# EAGLE schematic ball_speed_sensor (EAGLE 9.5.0)
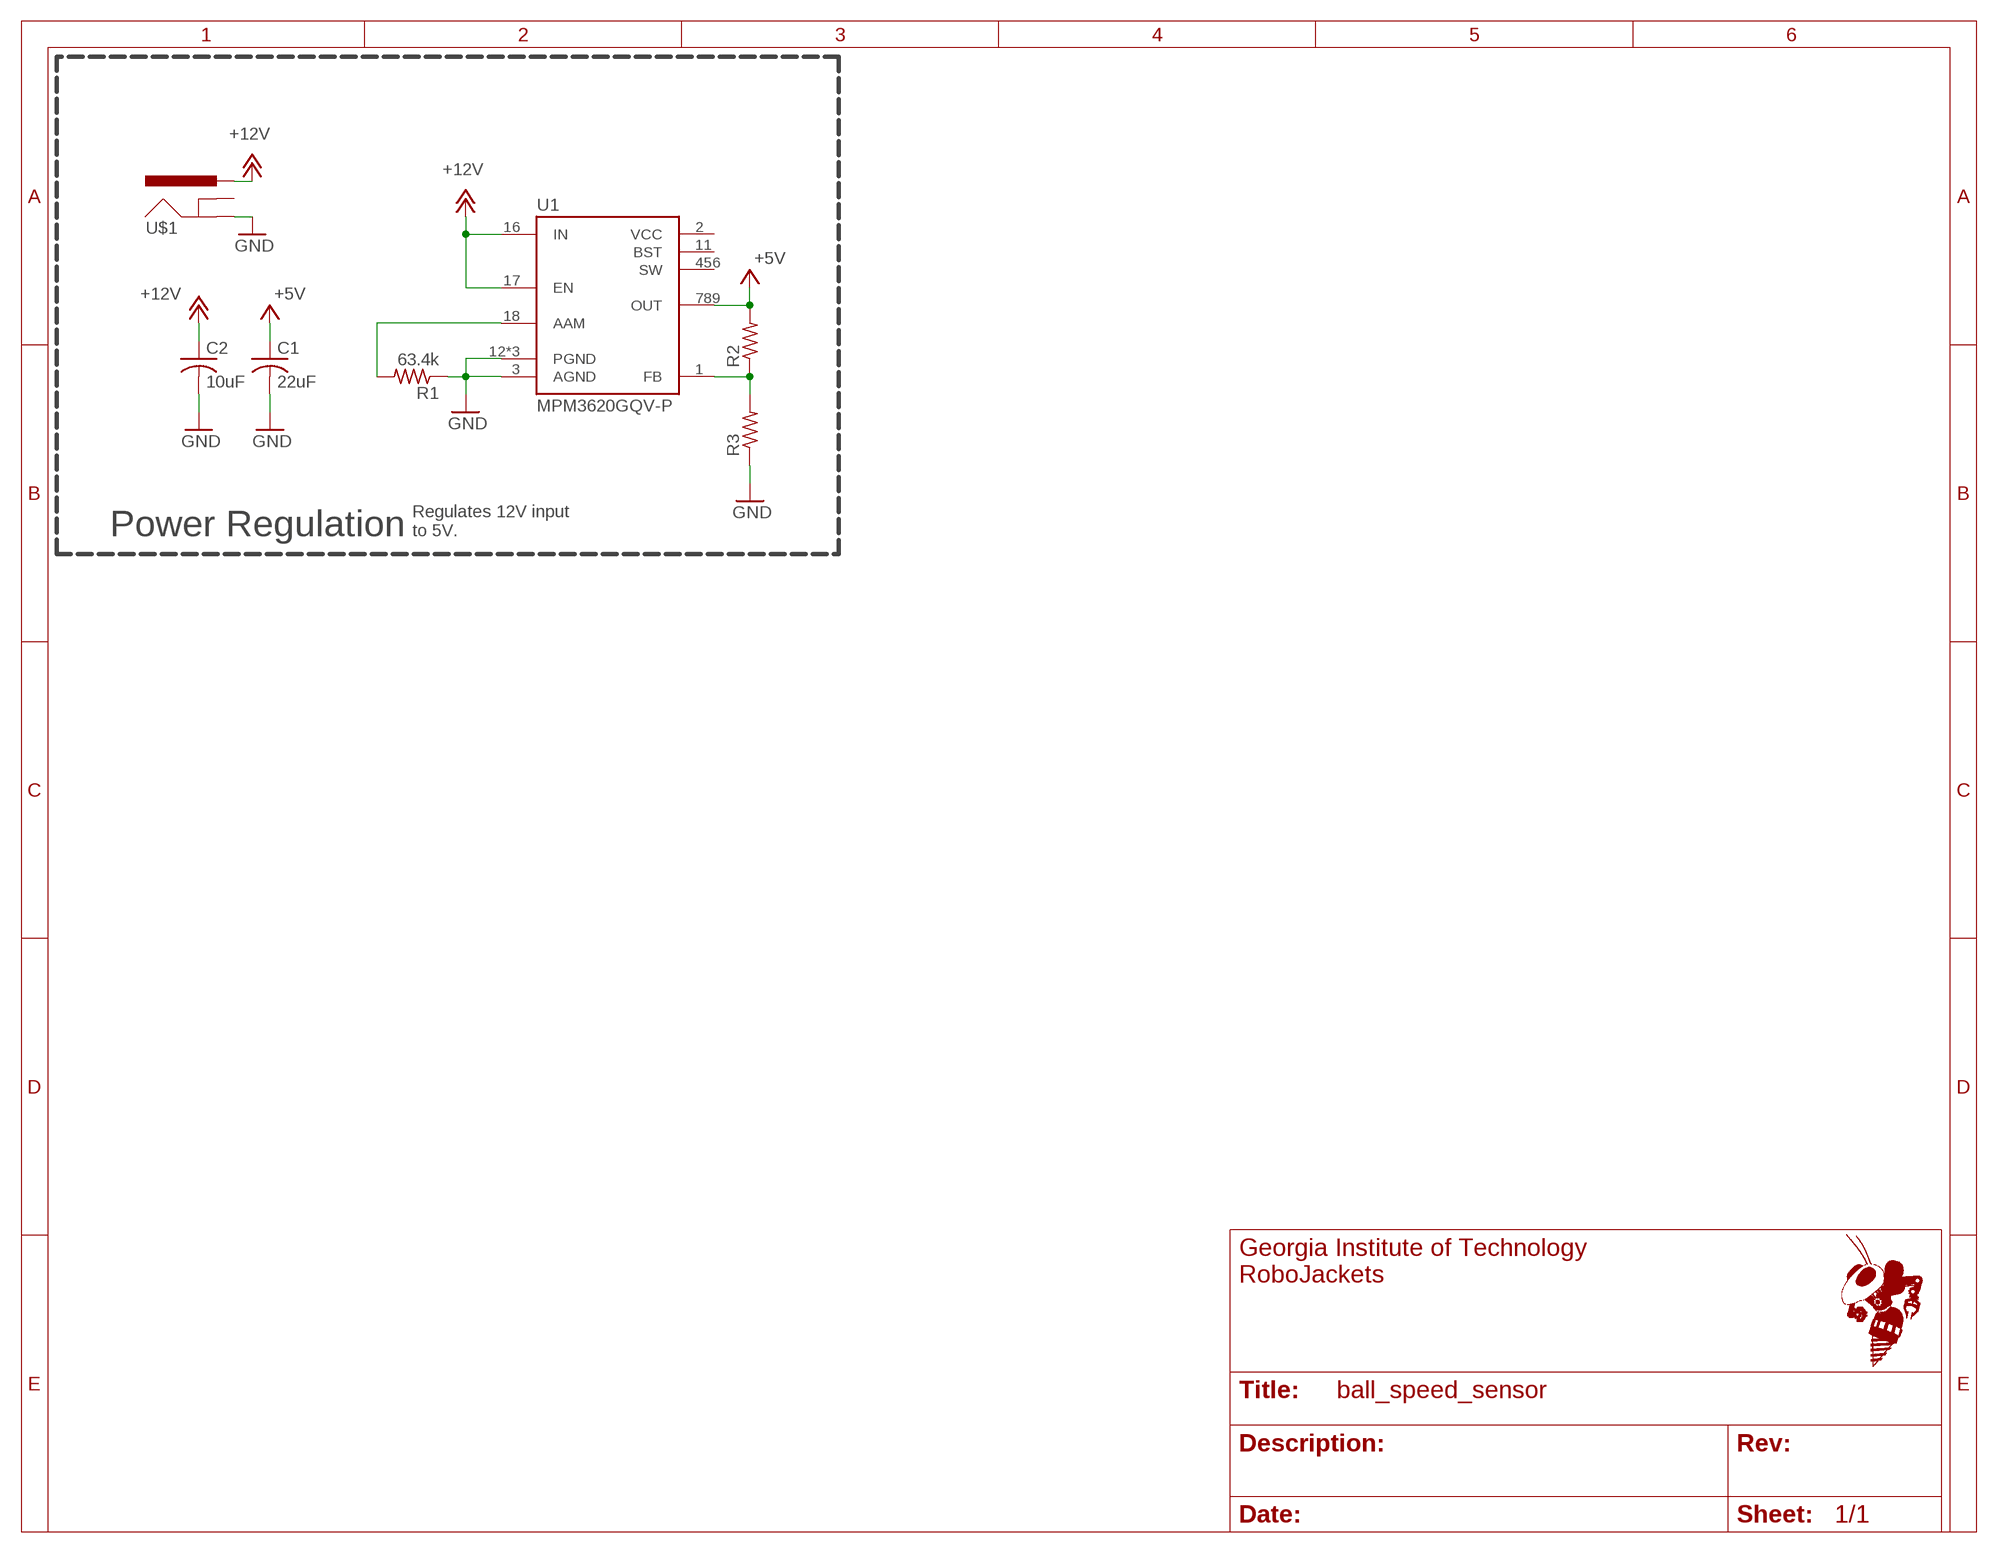
[diagram p0: schematic, sheet 1]

## Parts
C1  22uF  C-USC0603  [C0603]
C2  10uF  C-USC0603  [C0603]
R1  63.4k  R-US_R0603  [R0603]
R2  R-US_R0603  [R0603]
R3  R-US_R0603  [R0603]
U1  MPM3620GQV-P  [MPM3620GQV-P]
U$1  POWERJACK-2.1MM  [POWER_JACK_PTH]

## Nets
+5V: C1.1 R2.2 U1.789(OUT)
+12V: C2.1 U1.16(IN) U1.17(EN) U$1.PWR
GND: C1.2 C2.2 R1.1 R3.1 U1.3(AGND) U1.12(PGND) U1.13(PGND) U1.14(PGND) U$1.GND
N$1: R1.2 U1.18(AAM)
N$3: R2.1 R3.2 U1.1(FB)
Unconnected: U1.2(VCC) U1.11(BST) U1.456(SW) U$1.GNDBREAK

## Notes on the sheet
- Power Regulation
- Regulates 12V input
  to 5V.

## Library data of the parts
C1 C2 = rcl:C-US: CAPACITOR, American symbol; SPICEPREFIX: C
R1-R3 = rcl:R-US_: RESISTOR, American symbol; SPICEPREFIX: R
U1 = RoboJackets-PowerICs:MPM3620GQV-P
U$1 = powerjack-2.1mm:POWERJACK-2.1MM